# Altium schematic sheet Nucleo.SchDoc: Nucleo
size A4; Author: Attila Sághy; DocumentNumber: 1; Revision: 11; SheetNumber: 1; SheetTotal: 3
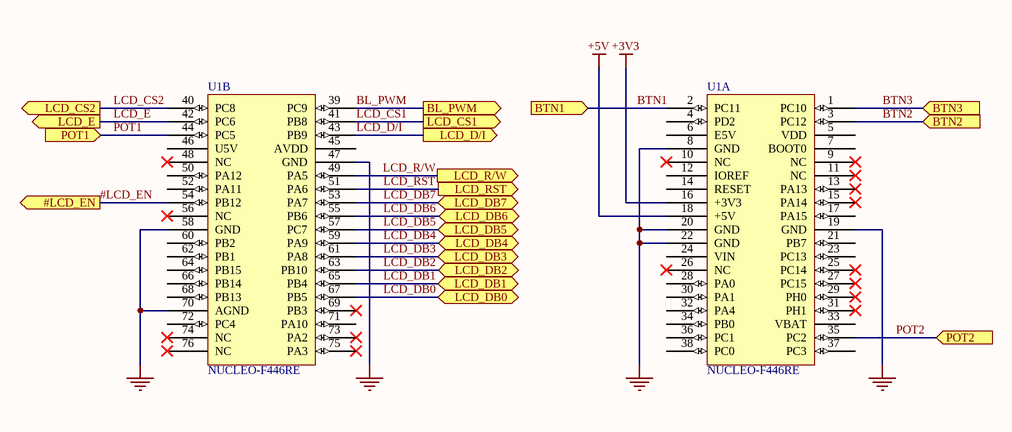
[diagram p0: Nucleo.SchDoc]

## Parts
U1  NUCLEO-F446RE  [FP_NUCLEO-64_2x20]  (parts A,B of 2)

## Ports
#LCD_EN (out), BL_PWM (out), BTN1 (in), BTN2 (in), BTN3 (in), LCD_CS1 (out), LCD_CS2 (out), LCD_D/I (out), LCD_DB0 (bidir), LCD_DB1 (bidir), LCD_DB2 (bidir), LCD_DB3 (bidir), LCD_DB4 (bidir), LCD_DB5 (bidir), LCD_DB6 (bidir), LCD_DB7 (bidir), LCD_E (out), LCD_R/W (out), LCD_RST (out), POT1 (in), POT2 (in)

## Nets
+3V3: U1.16(+3V3)
+5V: U1.18(+5V)
GND: U1.8(GND) U1.19(GND) U1.20(GND) U1.22(GND) U1.47(GND) U1.58(GND) U1.70(AGND)
#LCD_EN: U1.54(PB12) ; port #LCD_EN
BL_PWM: U1.39(PC9) ; port BL_PWM
BTN1: U1.2(PC11) ; port BTN1
BTN2: U1.3(PC12) ; port BTN2
BTN3: U1.1(PC10) ; port BTN3
LCD_CS1: U1.41(PB8) ; port LCD_CS1
LCD_CS2: U1.40(PC8) ; port LCD_CS2
LCD_D/I: U1.43(PB9) ; port LCD_D/I
LCD_DB0: U1.67(PB5) ; port LCD_DB0
LCD_DB1: U1.65(PB4) ; port LCD_DB1
LCD_DB2: U1.63(PB10) ; port LCD_DB2
LCD_DB3: U1.61(PA8) ; port LCD_DB3
LCD_DB4: U1.59(PA9) ; port LCD_DB4
LCD_DB5: U1.57(PC7) ; port LCD_DB5
LCD_DB6: U1.55(PB6) ; port LCD_DB6
LCD_DB7: U1.53(PA7) ; port LCD_DB7
LCD_E: U1.42(PC6) ; port LCD_E
LCD_R/W: U1.49(PA5) ; port LCD_R/W
LCD_RST: U1.51(PA6) ; port LCD_RST
POT1: U1.44(PC5) ; port POT1
POT2: U1.35(PC2) ; port POT2

Not connected (* = marked no-connect by the designer): U1 4(PD2) 5(VDD) 6(E5V) 7(BOOT0) 9(NC)* 10(NC)* 11(NC)* 12(IOREF) 13(PA13)* 14(RESET) 15(PA14)* 17(PA15) 21(PB7) 23(PC13) 24(VIN) 25(PC14)* 26(NC)* 27(PC15)* 28(PA0) 29(PH0)* 30(PA1) 31(PH1)* 32(PA4) 33(VBAT) 34(PB0) 36(PC1) 37(PC3) 38(PC0) 45(AVDD) 46(U5V) 48(NC)* 50(PA12) 52(PA11) 56(NC)* 60(PB2) 62(PB1) 64(PB15) 66(PB14) 68(PB13) 69(PB3)* 71(PA10) 72(PC4) 73(PA2)* 74(NC)* 75(PA3)* 76(NC)*

## Notes on the sheet
- Title
- Size:
- Date:
- A4
- Number:
- Time:
- Revision:
- Sheet
- of
- File:

## Library data of the parts
U1 = NUCLEO-F446RE: Development kit; Reference: NUCLEO; Name: Nucleo F446RE; Supplier: Tanszék